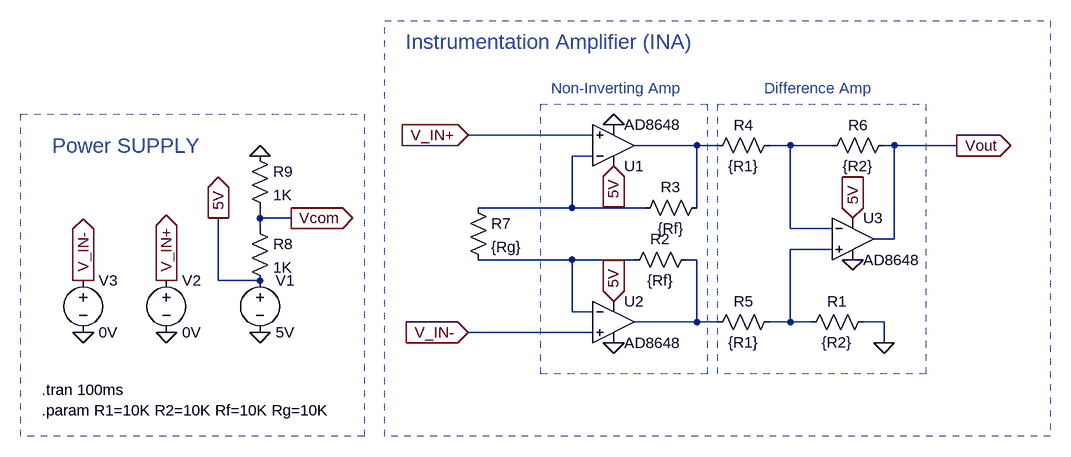
[diagram p0: schematic Sensor_LAB_1.asc]
Sensor_LAB_1.asc, the LTspice schematic file:
Version 4
SHEET 1 880 680
WIRE 96 16 -96 16
WIRE 256 32 160 32
WIRE 288 32 256 32
WIRE 400 32 368 32
WIRE 464 32 400 32
WIRE 560 32 544 32
WIRE 656 32 560 32
WIRE 96 48 64 48
WIRE 64 128 64 48
WIRE 64 128 -80 128
WIRE 176 128 64 128
WIRE 256 128 256 32
WIRE -416 144 -416 128
WIRE -368 144 -416 144
WIRE -416 160 -416 144
WIRE 400 160 400 32
WIRE 464 160 400 160
WIRE 560 176 560 32
WIRE 560 176 528 176
WIRE 464 192 400 192
WIRE 64 208 -80 208
WIRE 160 208 64 208
WIRE 256 208 240 208
WIRE -480 240 -480 144
WIRE -416 240 -480 240
WIRE 64 288 64 208
WIRE 96 288 64 288
WIRE 256 304 256 208
WIRE 256 304 160 304
WIRE 288 304 256 304
WIRE 400 304 400 192
WIRE 400 304 368 304
WIRE 432 304 400 304
WIRE 544 304 512 304
WIRE 96 320 -96 320
WIRE 544 336 544 304
FLAG 128 0 0
FLAG 128 336 0
FLAG 496 208 0
FLAG 128 272 5V
IOPIN 128 272 In
FLAG 128 64 5V
IOPIN 128 64 In
FLAG 496 144 5V
IOPIN 496 144 In
FLAG 656 32 Vout
IOPIN 656 32 Out
FLAG -416 320 0
FLAG -96 16 V_IN+
IOPIN -96 16 In
FLAG -96 320 V_IN-
IOPIN -96 320 In
FLAG -560 320 0
FLAG -688 320 0
FLAG -560 240 V_IN+
IOPIN -560 240 Out
FLAG -688 240 V_IN-
IOPIN -688 240 Out
FLAG -416 48 0
FLAG -368 144 Vcom
IOPIN -368 144 Out
FLAG -480 144 5V
IOPIN -480 144 Out
FLAG 544 336 0
SYMBOL OpAmps\\AD8648 128 96 M180
SYMATTR InstName U1
SYMBOL OpAmps\\AD8648 128 240 R0
SYMATTR InstName U2
SYMBOL OpAmps\\AD8648 496 112 R0
SYMATTR InstName U3
SYMBOL res 528 288 R90
WINDOW 0 0 56 VBottom 2
WINDOW 3 32 56 VTop 2
SYMATTR InstName R1
SYMATTR Value {R2}
SYMBOL res 256 192 R90
WINDOW 0 0 56 VBottom 2
WINDOW 3 32 56 VTop 2
SYMATTR InstName R2
SYMATTR Value {Rf}
SYMBOL res 272 112 R90
WINDOW 0 0 56 VBottom 2
WINDOW 3 32 56 VTop 2
SYMATTR InstName R3
SYMATTR Value {Rf}
SYMBOL res 384 16 R90
WINDOW 0 0 56 VBottom 2
WINDOW 3 32 56 VTop 2
SYMATTR InstName R4
SYMATTR Value {R1}
SYMBOL res 384 288 R90
WINDOW 0 0 56 VBottom 2
WINDOW 3 32 56 VTop 2
SYMATTR InstName R5
SYMATTR Value {R1}
SYMBOL res 560 16 R90
WINDOW 0 0 56 VBottom 2
WINDOW 3 32 56 VTop 2
SYMATTR InstName R6
SYMATTR Value {R2}
SYMBOL voltage -416 224 R0
WINDOW 123 0 0 Left 0
WINDOW 39 0 0 Left 0
SYMATTR InstName V1
SYMATTR Value 5V
SYMBOL voltage -560 224 R0
WINDOW 123 0 0 Left 0
WINDOW 39 0 0 Left 0
SYMATTR InstName V2
SYMATTR Value 0V
SYMBOL voltage -688 224 R0
WINDOW 123 0 0 Left 0
WINDOW 39 0 0 Left 0
SYMATTR InstName V3
SYMATTR Value 0V
SYMBOL res -96 112 R0
SYMATTR InstName R7
SYMATTR Value {Rg}
SYMBOL res -432 144 R0
SYMATTR InstName R8
SYMATTR Value 1K
SYMBOL res -432 32 R0
SYMATTR InstName R9
SYMATTR Value 1K
TEXT -752 440 Left 2 !.param R1=10K R2=10K Rf=10K Rg=10K
TEXT -736 32 Left 3 ;Power SUPPLY
TEXT -192 -128 Left 3 ;Instrumentation Amplifier (INA)
TEXT 32 -56 Left 2 ;Non-Inverting Amp
TEXT 360 -56 Left 2 ;Difference Amp
TEXT -752 408 Left 2 !.tran 100ms
RECTANGLE Normal -784 -16 -256 480 2
RECTANGLE Normal 272 384 16 -32 2
RECTANGLE Normal 608 384 288 -32 2
RECTANGLE Normal 800 480 -224 -160 2

The netlist it stands for:
* Sensor_LAB_1.asc
XU1 V_IN+ N003 5V 0 N001 AD8648  ; pins In+ In- V+ V- OUT
XU2 V_IN- N005 5V 0 N006 AD8648  ; pins In+ In- V+ V- OUT
XU3 N004 N002 5V 0 Vout AD8648  ; pins In+ In- V+ V- OUT
R1 0 N004 {R2}
R2 N006 N005 {Rf}
R3 N001 N003 {Rf}
R4 N002 N001 {R1}
R5 N004 N006 {R1}
R6 Vout N002 {R2}
V1 5V 0 5V
V2 V_IN+ 0 0V
V3 V_IN- 0 0V
R7 N003 N005 {Rg}
R8 Vcom 5V 1K
R9 0 Vcom 1K
.param R1=10K R2=10K Rf=10K Rg=10K
* Power SUPPLY
* Instrumentation Amplifier (INA)
* Non-Inverting Amp
* Difference Amp
.tran 100ms
.lib ADI.lib
.backanno
.end